# Altium schematic sheet RightSide.SchDoc
size A4; SheetNumber: 2; SheetTotal: 3
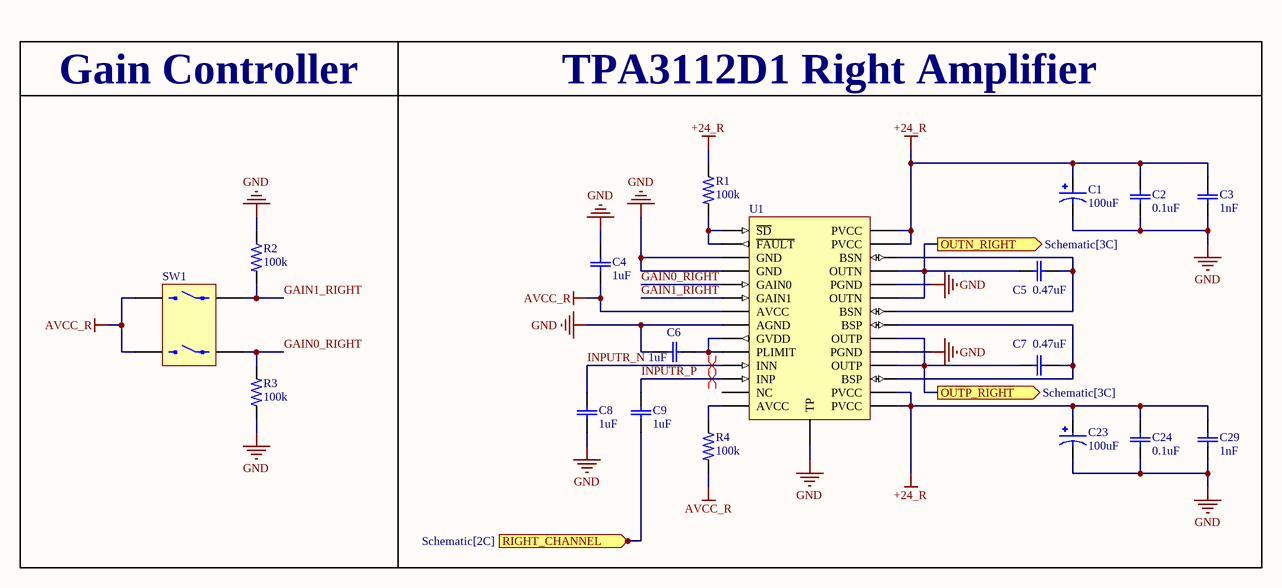
[diagram p0: RightSide.SchDoc]

## Parts
C1  100uF  [CAPRADIAL_16X10]
C2  0.1uF  [CERAMIC0805]
C3  1nF  [CERAMIC0603]
C4  1uF  [CERAMIC0603]
C5  0.47uF  [CERAMIC0603]
C6  1uF  [CERAMIC0603]
C7  0.47uF  [CERAMIC0603]
C8  1uF  [CERAMIC0603]
C9  1uF  [CERAMIC0603]
C23  100uF  [CAPRADIAL_16X10]
C24  0.1uF  [CERAMIC0805]
C29  1nF  [CERAMIC0603]
R1  100k  [RES0603]
R2  100k  [RES0603]
R3  100k  [RES0603]
R4  100k  [RES0603]
SW1  DIP SWITCH - 2 POS  [KF1001 - 2 POS]  (value not drawn)
U1  TPA3112D1  [HTSSOP-28]  (value not drawn)

## Ports
OUTN_RIGHT (out, see Schematic[3C]), OUTP_RIGHT (out, see Schematic[3C]), RIGHT_CHANNEL (in, see Schematic[2C])

## Nets
+24_R: C1.P C2.2(C2) C3.2(C2) C23.P C24.2(C2) C29.2(C2) R1.1 U1.15(PVCC) U1.16(PVCC) U1.27(PVCC) U1.28(PVCC)
AVCC_R: C4.2(C2) R4.2 SW1.2 SW1.3 U1.7(AVCC)
GND: C1.N C2.1(C1) C3.1(C1) C4.1(C1) C6.2(C2) C8.1(C1) C23.N C24.1(C1) C29.1(C1) R2.1 R3.1 U1.3(GND) U1.4(GND) U1.8(AGND) U1.19(PGND) U1.24(PGND) U1.29(TP)
GAIN0_RIGHT: R3.2 SW1.1 U1.5(GAIN0)
GAIN1_RIGHT: R2.2 SW1.4 U1.6(GAIN1)
INPUTR_N: C8.2(C2) U1.11(INN)
INPUTR_P: C9.2(C2) U1.12(INP)
OUTN_RIGHT: C5.2(C2) U1.23(OUTN) U1.25(OUTN) ; port OUTN_RIGHT
OUTP_RIGHT: C7.2(C2) U1.18(OUTP) U1.20(OUTP) ; port OUTP_RIGHT
RIGHT_CHANNEL: C9.1(C1) ; port RIGHT_CHANNEL
NetC5_1: C5.1(C1) U1.22(BSN) U1.26(BSN)
NetC6_1: C6.1(C1) U1.9(GVDD) U1.10(PLIMIT)
NetC7_1: C7.1(C1) U1.17(BSP) U1.21(BSP)
NetR1_2: R1.2 U1.1(~{SD}) U1.2(~{FAULT})
NetR4_1: R4.1 U1.14(AVCC)

Not connected (* = marked no-connect by the designer): U1 13(NC)

## Layout directives
differential pair: INPUTR_N, INPUTR_P

## Notes on the sheet
- Gain Controller
- TPA3112D1 Right Amplifier

## Library data of the parts
C1 C23 = CAP ELETRO/TANT: MP: EEU-EE2W560; MF: Panasonic; Digi-Key_Part_Number: P13679-ND; Check_prices: https://www.snapeda.com/parts/EEU-EE2W560/Panasonic/view-part/2337485/?ref=eda; Value: *; SnapEDA_Link: https://www.snapeda.com/parts/EEU-EE2W560/Panasonic/view-part/2337485/?ref=snap; Purchase-URL: https://pricing.snapeda.com/search/part/EEU-EE2W560/?ref=eda; Package: RADIAL-2 Panasonic
C2-C9 C24 C29 = Cap: MF: KEMET; MP: TAJC226M025RNJ; SnapEDA_Link: https://www.snapeda.com/parts/TAJC226M025RNJ/KEMET/view-part/?ref=snap; Availability: In Stock; Price: None; Purchase-URL: https://pricing.snapeda.com/search/part/TAJC226M025RNJ/?ref=eda; Package: None; Check_prices: https://www.snapeda.com/parts/TAJC226M025RNJ/KEMET/view-part/?ref=eda; Value: *
R1-R4 = RESISTOR SMD: MP: 3-1879460-6; Package: None; Price: None; Value: *; Availability: Unavailable
U1 = TPA3112D1: 25W Filter-Free Mono Class-D Audio Power Amplifier